# Altium schematic sheet STM32F031C6T6.SchDoc
size A4
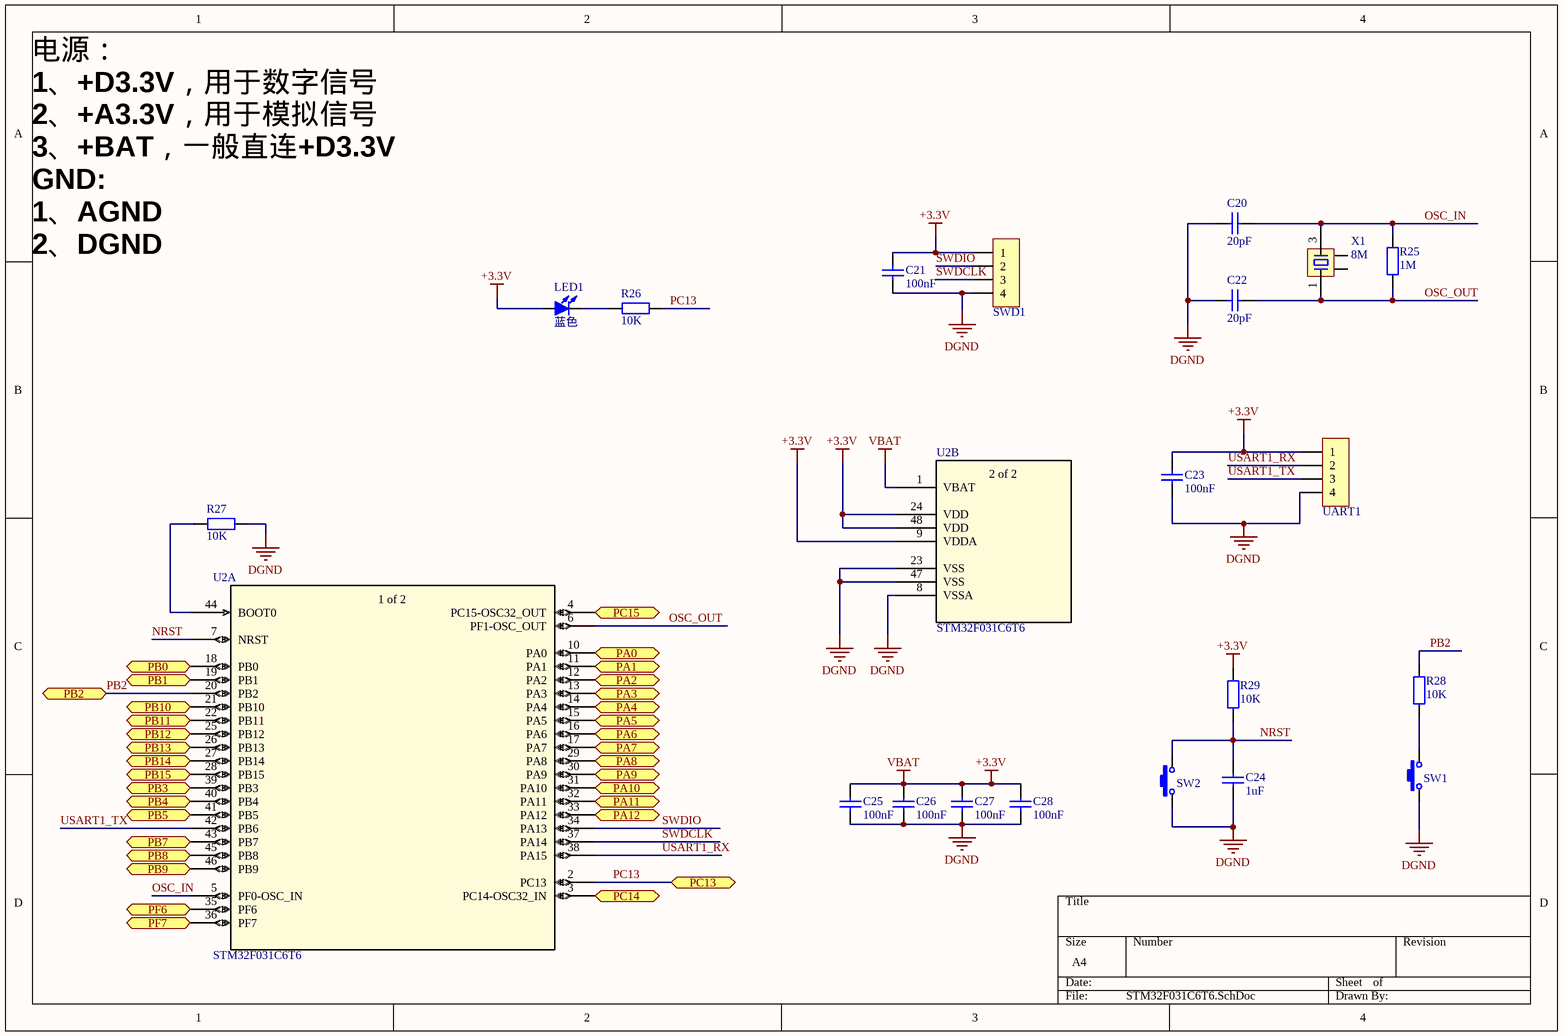
[diagram p0: STM32F031C6T6.SchDoc]

## Parts
C20  20pF  [C0603_M]
C21  100nF  [C0603_M]
C22  20pF  [C0603_M]
C23  100nF  [C0603_M]
C24  1uF  [C0603_M]
C25  100nF  [C0603_M]
C26  100nF  [C0603_M]
C27  100nF  [C0603_M]
C28  100nF  [C0603_M]
LED1  蓝色  [LED0603_B]
R25  1M  [R0603_M]
R26  10K  [R0603_M]
R27  10K  [R0603_M]
R28  10K  [R0603_M]
R29  10K  [R0603_M]
SW1  3x6x5  [SW 3*6*4.3-S-W]  (value not drawn)
SW2  3x6x5  [SW 3*6*4.3-S-W]  (value not drawn)
SWD1  HDR-1X4  [ZH1.5-WS-4P]  (value not drawn)
U2  STM32F031C6T6  [LQFP48-7x7mm]  (parts A,B of 2)
UART1  HDR-1X4  [ZH1.5-WS-4P]  (value not drawn)
X1  8M  [XTAL-3225-4P]

## Ports
PA0 (bidir), PA1 (bidir), PA2 (bidir), PA3 (bidir), PA4 (bidir), PA5 (bidir), PA6 (bidir), PA7 (bidir), PA8 (bidir), PA9 (bidir), PA10 (bidir), PA11 (bidir), PA12 (bidir), PB0 (bidir), PB1 (bidir), PB2 (bidir), PB3 (bidir), PB4 (bidir), PB5 (bidir), PB7 (bidir), PB8 (bidir), PB9 (bidir), PB10 (bidir), PB11 (bidir), PB12 (bidir), PB13 (bidir), PB14 (bidir), PB15 (bidir), PC13 (bidir), PC14 (bidir), PC15 (bidir), PF6 (bidir), PF7 (bidir)

## Nets
+3.3V: C21.2 C23.2 C25.2 C26.2 C27.2 C28.2 LED1.1(A) R29.2 SWD1.1 U2.1(VBAT) U2.9(VDDA) U2.24(VDD) U2.48(VDD) UART1.1  [also labelled VBAT]
DGND: C20.2 C21.1 C22.2 C23.1 C24.1 C25.1 C26.1 C27.1 C28.1 R27.1 SW1.1 SW2.1 SWD1.4 U2.8(VSSA) U2.23(VSS) U2.47(VSS) UART1.4
NRST: C24.2 R29.1 SW2.2 U2.7(NRST)
OSC_IN: C20.1 R25.1 U2.5(PF0-OSC_IN) X1.3
OSC_OUT: C22.1 R25.2 U2.6(PF1-OSC_OUT) X1.1
PA0: U2.10(PA0) ; port PA0
PA1: U2.11(PA1) ; port PA1
PA2: U2.12(PA2) ; port PA2
PA3: U2.13(PA3) ; port PA3
PA4: U2.14(PA4) ; port PA4
PA5: U2.15(PA5) ; port PA5
PA6: U2.16(PA6) ; port PA6
PA7: U2.17(PA7) ; port PA7
PA8: U2.29(PA8) ; port PA8
PA9: U2.30(PA9) ; port PA9
PA10: U2.31(PA10) ; port PA10
PA11: U2.32(PA11) ; port PA11
PA12: U2.33(PA12) ; port PA12
PB0: U2.18(PB0) ; port PB0
PB1: U2.19(PB1) ; port PB1
PB2: R28.2 U2.20(PB2) ; port PB2
PB3: U2.39(PB3) ; port PB3
PB4: U2.40(PB4) ; port PB4
PB5: U2.41(PB5) ; port PB5
PB7: U2.43(PB7) ; port PB7
PB8: U2.45(PB8) ; port PB8
PB9: U2.46(PB9) ; port PB9
PB10: U2.21(PB10) ; port PB10
PB11: U2.22(PB11) ; port PB11
PB12: U2.25(PB12) ; port PB12
PB13: U2.26(PB13) ; port PB13
PB14: U2.27(PB14) ; port PB14
PB15: U2.28(PB15) ; port PB15
PC13: R26.1 U2.2(PC13) ; port PC13
PC14: U2.3(PC14-OSC32_IN) ; port PC14
PC15: U2.4(PC15-OSC32_OUT) ; port PC15
PF6: U2.35(PF6) ; port PF6
PF7: U2.36(PF7) ; port PF7
SWDCLK: SWD1.3 U2.37(PA14)
SWDIO: SWD1.2 U2.34(PA13)
USART1_RX: U2.38(PA15) UART1.2
USART1_TX: U2.42(PB6) UART1.3
NetLED1_2: LED1.2(K) R26.2
NetR27_2: R27.2 U2.44(BOOT0)
NetR28_1: R28.1 SW1.2

Not connected (* = marked no-connect by the designer): X1 2 4

## Notes on the sheet
- 电源：
  1、+D3.3V，用于数字信号
  2、+A3.3V，用于模拟信号
  3、+BAT，一般直连+D3.3V
  GND:
  1、AGND
  2、DGND
- (in symbol STM32F031C6T6, part A) 1 of 2
- (in symbol STM32F031C6T6, part B) 2 of 2

## Library data of the parts
C20-C28 = C: 贴片电容/MLCC电容; BOM名称: 无极性贴片电容; 联系卖家，免费查找封装: 唯一出售店铺网址https://shop463601444.taobao.com
LED1 = LED-SMD: 贴片LED; 封装库来自淘宝卖家ID：黄晶宝石: 其他店铺购入均为盗版封装库，请立即申请退款，本店现金奖励20~200元; BOM名称: 贴片LED
R25-R29 = R: 贴片电阻; 联系卖家，免费查找封装: 唯一出售店铺网址https://shop463601444.taobao.com; BOM名称: 贴片电阻
SW1 SW2 = SW 3x6: 3x6轻触开关; 联系卖家，免费查找封装: 唯一出售店铺网址https://shop463601444.taobao.com; 封装库来自淘宝卖家ID:黄晶宝石: 其他店铺购入均为盗版假冒封装库，请立即申请退款，本店现金奖励20~200元; BOM名称: 3x6轻触开关
SWD1 UART1 = Header 4: 4P接插件; 联系卖家，免费查找封装: 唯一出售店铺网址https://shop463601444.taobao.com; BOM名称: 4P接插件
U2 = STM32F031C6T6: No Description Available; Mfr_Name: STMicroelectronics; Copyright: Copyright (C) 2021 Ultra Librarian. All rights reserved.; Manufacturer_Part_Number: STM32F031C6T6; RefDes: RefDes; Type: DEV
X1 = XTAL-4P: 4脚无源晶振(谐振器）; 联系卖家，免费查找封装: 唯一出售店铺网址https://shop463601444.taobao.com; BOM名称: 4脚无源晶振(谐振器）